# Altium project Ethernet_SPI_ENC28J60.PrjPCB
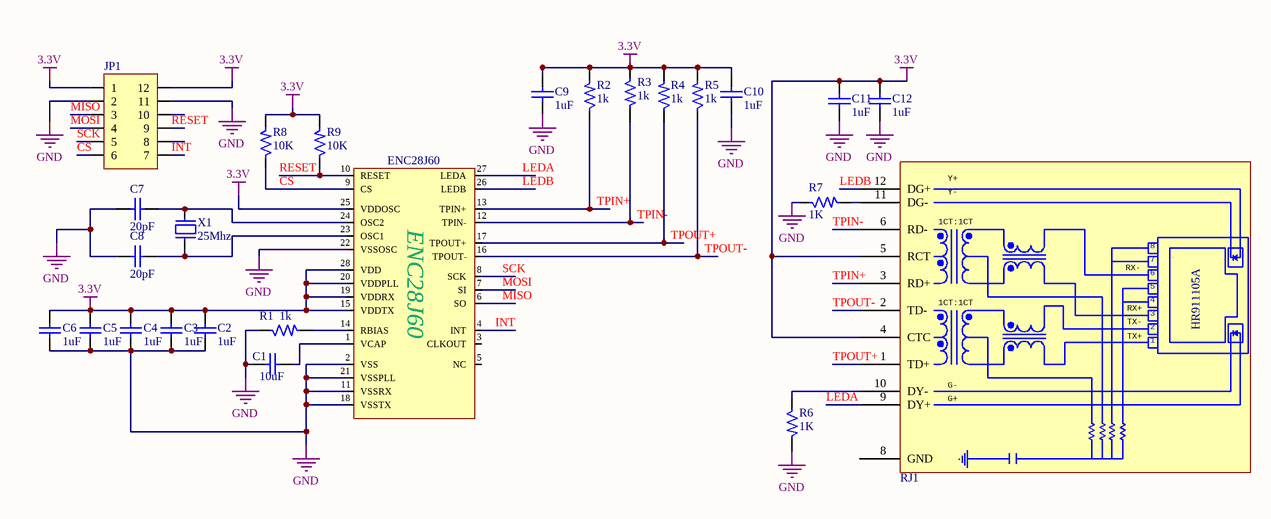
[diagram p0: Schematic.SchDoc]
1 sheet, 25 parts. Net scope: global (net labels, ports and power ports of the same name join across sheets).
Board file: PCB.PcbDoc

## Sheet Schematic.SchDoc
size A

### Parts
C1  10uF  [CAP_0805]
C2  1uF  [CAP_0805]
C3  1uF  [CAP_0805]
C4  1uF  [CAP_0805]
C5  1uF  [CAP_0805]
C6  1uF  [CAP_0805]
C7  20pF  [CAP_0805]
C8  20pF  [CAP_0805]
C9  1uF  [CAP_0805]
C10  1uF  [CAP_0805]
C11  1uF  [CAP_0805]
C12  1uF  [CAP_0805]
ENC28J60  ENC28J60?  [SOP_28M_127]  (value not drawn)
JP1  JP6x2  [JP6-D2T]  (value not drawn)
R1  1k  [RES_0805]
R2  1k  [RES_0805]
R3  1k  [RES_0805]
R4  1k  [RES_0805]
R5  1k  [RES_0805]
R6  1K  [RES_0805]
R7  1K  [RES_0805]
R8  10K  [RES_0805]
R9  10K  [RES_0805]
RJ1  RJ45  [RJ45]  (value not drawn)
X1  25Mhz  [XT2]

### Nets
3.3V: C2.1 C3.1 C4.2 C5.1 C6.1 C9.2 C10.1 C11.1 C12.1 ENC28J60.15(VDDTX) ENC28J60.19(VDDRX) ENC28J60.20(VDDPLL) ENC28J60.25(VDDOSC) ENC28J60.28(VDD) JP1.1 JP1.12 R2.2 R3.1 R4.2 R5.2 R8.2 R9.2 RJ1.4(CTC) RJ1.5(RCT)
GND: C1.1 C2.2 C3.2 C4.1 C5.2 C6.2 C7.1 C8.1 C9.1 C10.2 C11.2 C12.2 ENC28J60.2(VSS) ENC28J60.11(VSSRX) ENC28J60.18(VSSTX) ENC28J60.21(VSSPLL) ENC28J60.22(VSSOSC) JP1.2 JP1.11 R1.1 R6.2 R7.1
CS: ENC28J60.9(CS) JP1.6 R8.1
INT: ENC28J60.4(INT) JP1.7
LEDA: ENC28J60.27(LEDA) RJ1.9(DY+)
LEDB: ENC28J60.26(LEDB) RJ1.12(DG+)
MISO: ENC28J60.6(SO) JP1.3
MOSI: ENC28J60.7(SI) JP1.4
RESET: ENC28J60.10(RESET) JP1.9 R9.1
SCK: ENC28J60.8(SCK) JP1.5
TPIN+: ENC28J60.13(TPIN+) R2.1 RJ1.3(RD+)
TPIN-: ENC28J60.12(TPIN-) R3.2 RJ1.6(RD-)
TPOUT+: ENC28J60.17(TPOUT+) R4.1 RJ1.1(TD+)
TPOUT-: ENC28J60.16(TPOUT-) R5.1 RJ1.2(TD-)
NetC1_2: C1.2 ENC28J60.1(VCAP)
NetC7_2: C7.2 ENC28J60.24(OSC2) X1.2
NetC8_2: C8.2 ENC28J60.23(OSC1) X1.1
NetENC28J60_14: ENC28J60.14(RBIAS) R1.2
NetR6_1: R6.1 RJ1.10(DY-)
NetR7_2: R7.2 RJ1.11(DG-)

Not connected (* = marked no-connect by the designer): ENC28J60 3(CLKOUT) 5(NC); JP1 8 10; RJ1 8(GND)

### Notes on the sheet
- (in symbol RJ45-Con) Y+; Y-; 1CT:1CT; 7; RX-; RX+; TX-; HR911105A; TX+; G-; G+

### Library data of the parts
C1-C12 = CapSMD: Capacitor; Value: 33p; Published: 8-Jun-2000; LatestRevisionDate: 17-Jul-2002; LatestRevisionNote: Re-released for DXP Platform.; PackageReference: RAD-0.3; Publisher: Altium Limited
ENC28J60 = ENC28J60
JP1 = JP6x2: WR-PHD 2.54 mm Dual Socket Header; Manufacturer: W¨¹rth Elektronik eiSos GmbH; partNo: 61301221821; ComponentLink1 Description: Manufacturer; ComponentLink2 Description: Datasheet; NoPins: 12; Created Date: 29 March 2013; ComponentLink1URL: http://www.we-online.com; ComponentLink2URL: http://katalog.we-online.de/em/datasheet/6130xx21821.pdf; Created by: Karrer Zheng
R1-R9 = Res_0805: Resistor 1/4W; Value: R1/4W - 1K
RJ1 = RJ45-Con
X1 = XT2: Crystal, 32.768 KHz, -40 to 85 degC, 3.2 x 1.5 x 0.9 mm SMD; Value: 4Mhz